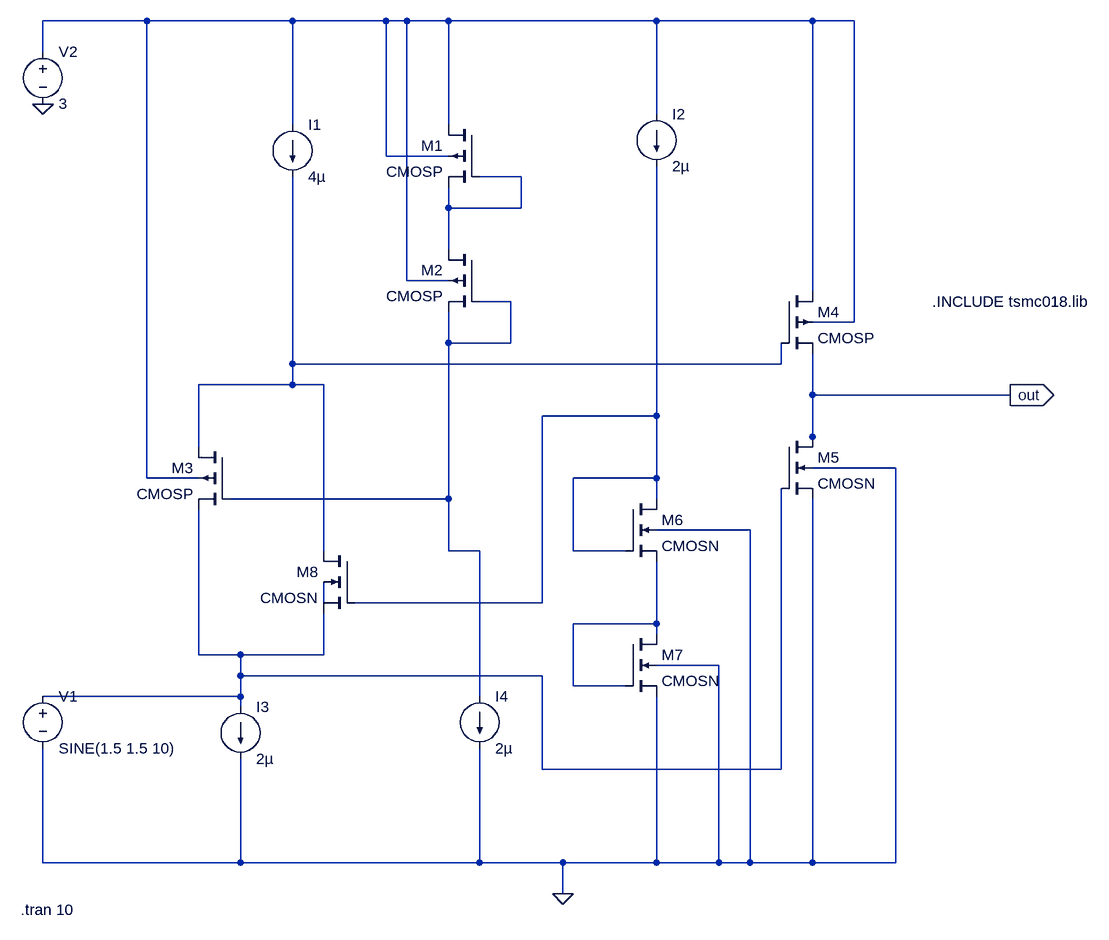
[diagram p0: schematic Output rail to rail.asc]
Output rail to rail.asc, the LTspice schematic file:
Version 4
SHEET 1 880 1000
WIRE -880 -384 -1040 -384
WIRE -656 -384 -880 -384
WIRE -512 -384 -656 -384
WIRE -480 -384 -512 -384
WIRE -416 -384 -480 -384
WIRE -96 -384 -416 -384
WIRE 144 -384 -96 -384
WIRE 208 -384 144 -384
WIRE -1040 -336 -1040 -384
WIRE -96 -240 -96 -384
WIRE -656 -224 -656 -384
WIRE -416 -224 -416 -384
WIRE -512 -176 -512 -384
WIRE -416 -176 -512 -176
WIRE -304 -144 -368 -144
WIRE -416 -96 -416 -128
WIRE -304 -96 -304 -144
WIRE -304 -96 -416 -96
WIRE -416 -32 -416 -96
WIRE -480 16 -480 -384
WIRE -416 16 -480 16
WIRE 144 32 144 -384
WIRE -320 48 -368 48
WIRE 208 80 208 -384
WIRE 208 80 144 80
WIRE -416 112 -416 64
WIRE -320 112 -320 48
WIRE -320 112 -416 112
WIRE -656 144 -656 -144
WIRE 96 144 96 112
WIRE 96 144 -656 144
WIRE -656 176 -656 144
WIRE -656 176 -800 176
WIRE -608 176 -656 176
WIRE 144 192 144 128
WIRE 448 192 144 192
WIRE -96 224 -96 -160
WIRE -96 224 -272 224
WIRE 144 256 144 192
WIRE -800 272 -800 176
WIRE 144 272 144 256
WIRE 272 304 144 304
WIRE -880 320 -880 -384
WIRE -800 320 -880 320
WIRE -96 320 -96 224
WIRE -96 320 -224 320
WIRE -416 352 -416 112
WIRE -416 352 -752 352
WIRE -96 352 -96 320
WIRE 48 400 -96 400
WIRE -608 432 -608 176
WIRE -416 432 -416 352
WIRE -368 432 -416 432
WIRE -224 432 -224 320
WIRE -144 432 -224 432
WIRE -608 512 -608 480
WIRE -272 512 -272 224
WIRE -272 512 -560 512
WIRE -96 544 -96 448
WIRE -96 544 -224 544
WIRE -96 560 -96 544
WIRE -800 592 -800 368
WIRE -736 592 -800 592
WIRE -608 592 -608 528
WIRE -608 592 -736 592
WIRE 0 608 -96 608
WIRE -736 624 -736 592
WIRE -272 624 -736 624
WIRE -224 640 -224 544
WIRE -144 640 -224 640
WIRE -736 656 -736 624
WIRE -736 656 -1040 656
WIRE -368 656 -368 432
WIRE -736 672 -736 656
WIRE -272 768 -272 624
WIRE 96 768 96 336
WIRE 96 768 -272 768
WIRE -1040 912 -1040 736
WIRE -736 912 -736 752
WIRE -736 912 -1040 912
WIRE -368 912 -368 736
WIRE -368 912 -736 912
WIRE -240 912 -368 912
WIRE -96 912 -96 656
WIRE -96 912 -240 912
WIRE 0 912 0 608
WIRE 0 912 -96 912
WIRE 48 912 48 400
WIRE 48 912 0 912
WIRE 144 912 144 352
WIRE 144 912 48 912
WIRE 272 912 272 304
WIRE 272 912 144 912
WIRE -240 960 -240 912
FLAG -240 960 0
FLAG -1040 -256 0
FLAG 448 192 out
IOPIN 448 192 Out
SYMBOL cmosp -368 -224 M0
SYMATTR InstName M1
SYMATTR Value2 l=400n w=1600n
SYMBOL cmosp -368 -32 M0
SYMATTR InstName M2
SYMATTR Value2 l=400n w=1600n
SYMBOL cmosp -752 272 M0
SYMATTR InstName M3
SYMATTR Value2 l=400n w=1600n
SYMBOL cmosp 96 32 R0
SYMATTR InstName M4
SYMATTR Value2 l=400n w=1600n
SYMBOL cmosn 96 256 R0
SYMATTR InstName M5
SYMATTR Value2 l=400n w=1600n
SYMBOL cmosn -144 352 R0
SYMATTR InstName M6
SYMATTR Value2 l=400n w=1600n
SYMBOL cmosn -144 560 R0
SYMATTR InstName M7
SYMATTR Value2 l=400n w=1600n
SYMBOL cmosn -560 432 M0
SYMATTR InstName M8
SYMATTR Value2 l=400n w=1600n
SYMBOL voltage -1040 640 R0
WINDOW 123 0 0 Left 0
WINDOW 39 0 0 Left 0
SYMATTR InstName V1
SYMATTR Value SINE(1.5 1.5 10)
SYMBOL current -656 -224 R0
WINDOW 123 0 0 Left 0
WINDOW 39 0 0 Left 0
SYMATTR InstName I1
SYMATTR Value 4µ
SYMBOL current -96 -240 R0
WINDOW 123 0 0 Left 0
WINDOW 39 0 0 Left 0
SYMATTR InstName I2
SYMATTR Value 2µ
SYMBOL current -736 672 R0
WINDOW 123 0 0 Left 0
WINDOW 39 0 0 Left 0
SYMATTR InstName I3
SYMATTR Value 2µ
SYMBOL current -368 656 R0
WINDOW 123 0 0 Left 0
WINDOW 39 0 0 Left 0
SYMATTR InstName I4
SYMATTR Value 2µ
SYMBOL voltage -1040 -352 R0
WINDOW 123 0 0 Left 0
WINDOW 39 0 0 Left 0
SYMATTR InstName V2
SYMATTR Value 3
TEXT 328 48 Left 2 !.INCLUDE tsmc018.lib
TEXT -1074 984 Left 2 !.tran 10

The netlist it stands for:
* Output rail to rail.asc
M1 N001 N002 N002 N001 CMOSP l=400n w=1600n
M2 N002 N003 N003 N001 CMOSP l=400n w=1600n
M3 N004 N003 N008 N001 CMOSP l=400n w=1600n
M4 N001 N004 out N001 CMOSP l=400n w=1600n
M5 out N008 0 0 CMOSN l=400n w=1600n
M6 N005 N005 N007 0 CMOSN l=400n w=1600n
M7 N007 N007 0 0 CMOSN l=400n w=1600n
M8 N004 N005 N008 N006 CMOSN l=400n w=1600n
V1 N008 0 SINE(1.5 1.5 10)
I1 N001 N004 4µ
I2 N001 N005 2µ
I3 N008 0 2µ
I4 N003 0 2µ
V2 N001 0 3
.model NMOS NMOS
.model PMOS PMOS
.lib standard.mos
.INCLUDE tsmc018.lib
.tran 10
.backanno
.end